# EAGLE design NanoCard (EAGLE 9.5.0)
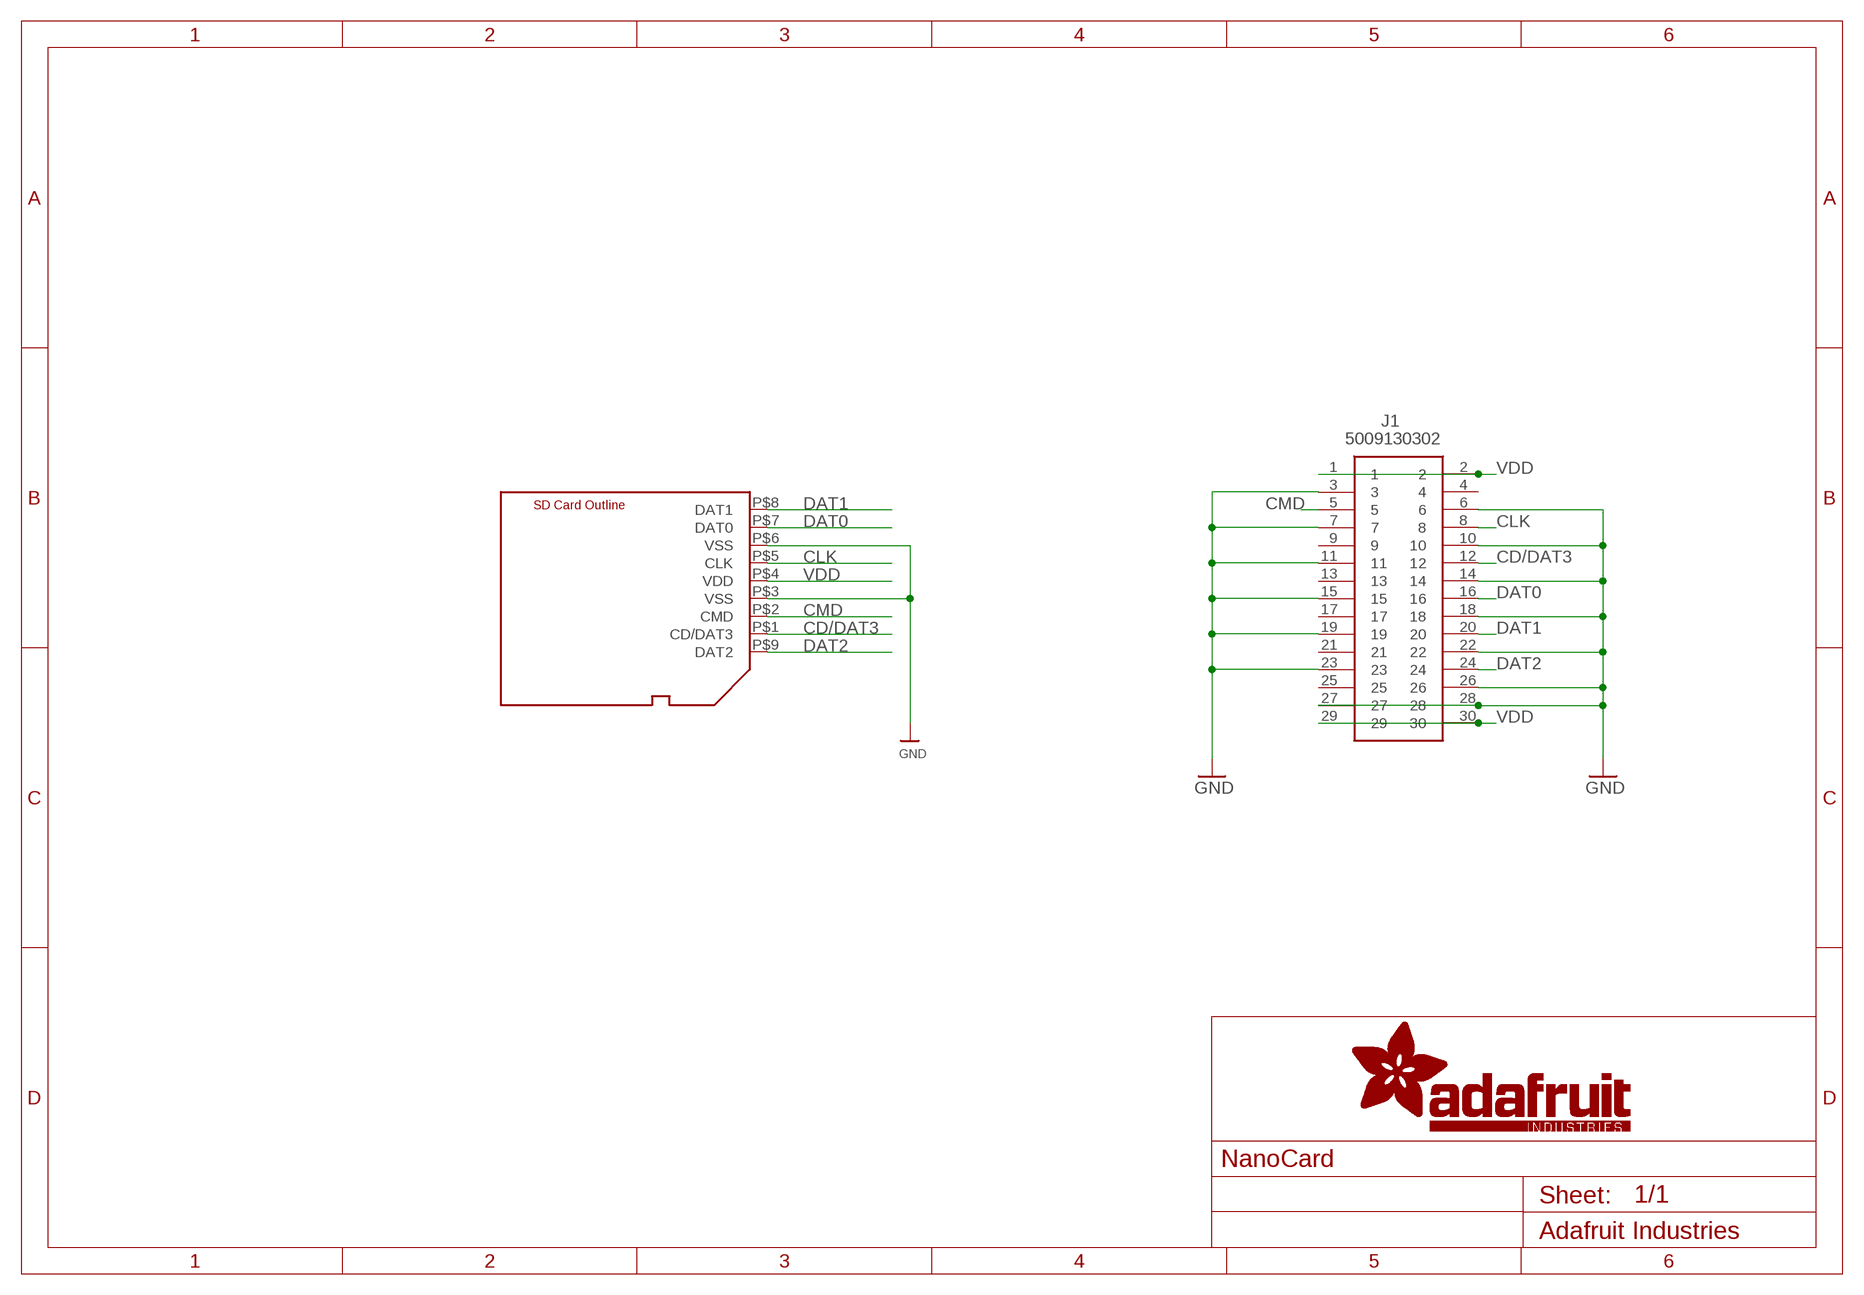
[diagram p0: schematic, sheet 1]

## Parts
J1  5009130302  [500913-0302]
U$2  SDCARD_PCBCARRIERTDOCU  [SDCARD_PCBCARRIER_DOCU]

## Nets
CD/DAT3: J1.12 U$2.P$1(CD/DAT3)
CLK: J1.8 U$2.P$5(CLK)
CMD: J1.5 U$2.P$2(CMD)
DAT0: J1.16 U$2.P$7(DAT0)
DAT1: J1.20 U$2.P$8(DAT1)
DAT2: J1.24 U$2.P$9(DAT2)
GND: J1.3 J1.6 J1.7 J1.10 J1.11 J1.14 J1.15 J1.18 J1.19 J1.22 J1.23 J1.26 J1.27 J1.28 U$2.P$3(VSS) U$2.P$6(VSS)
VDD: J1.1 J1.2 J1.29 J1.30 U$2.P$4(VDD)
Unconnected: J1.4 J1.9 J1.13 J1.17 J1.21 J1.25

## Library data of the parts
J1 = SamacSys_Parts:5009130302: CONN RCPT 30POS 0.4MM SMD GOLD Source: Datasheet <https://www.molex.com/pdm_docs/sd/5009130302_sd.pdf>; DESCRIPTION: CONN RCPT 30POS 0.4MM SMD GOLD; HEIGHT: mm; MANUFACTURER_NAME: Molex; MANUFACTURER_PART_NUMBER: 5009130302
U$2 = microbuilder:SDCARD_PCBCARRIER: Physical PCB representing an SD Card

## Board
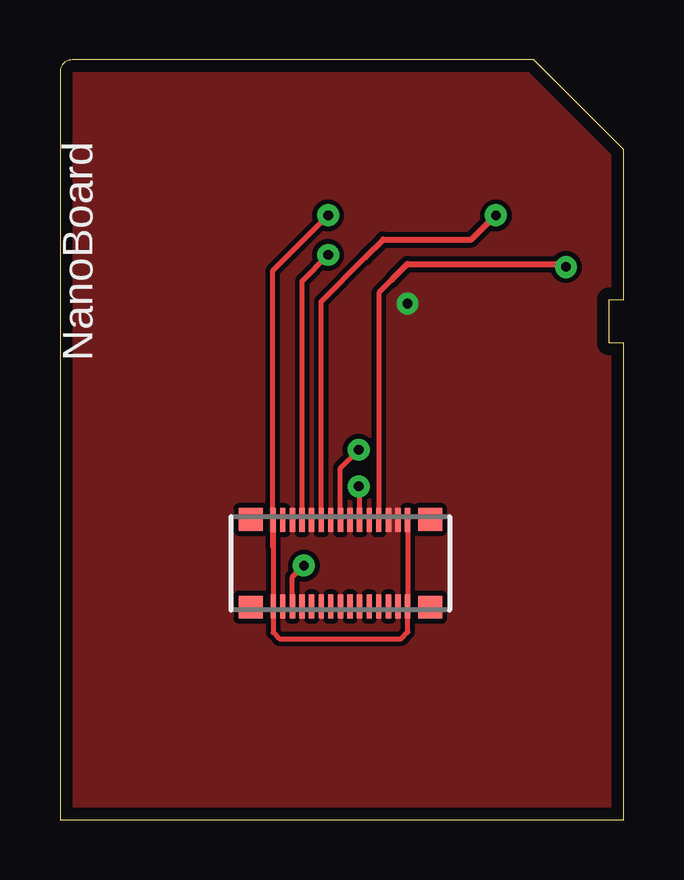
[diagram p1: board, top side]
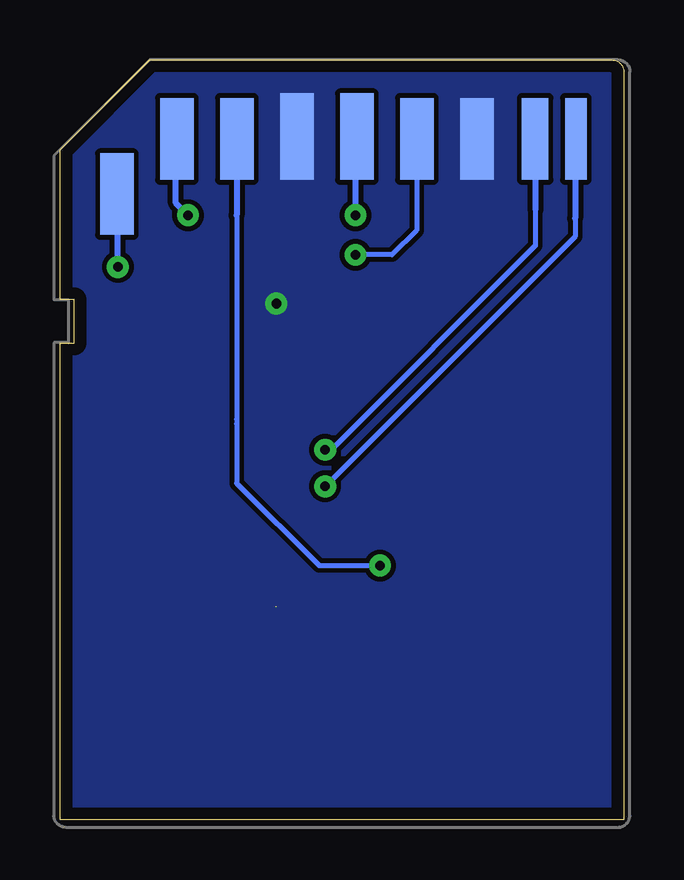
[diagram p2: board, bottom side, seen from below]

Size 23.49 x 31.67 mm. Coordinates in mm from the lower left corner, seen from the top.
Outline: 0,0 23.49,0 23.49,19.87 22.89,19.87 22.89,21.67 23.49,21.67 23.49,27.93 19.75,31.67 0.5,31.67 arc90 0,31.17 0,0
Copper layers (1*16): Top 0.035mm / dielectric 1.5mm / Bottom 0.035mm
Design rules "default *": minimum track width 8mil, minimum drill 0.4mm, track to track 8mil, track to pad 8mil, pad to pad 8mil, via to via 8mil, smd to smd 8mil, copper to edge 20mil, drill to drill 8mil, minimum pad ring 8mil, minimum via ring 10mil, stop-mask expansion 3mil, vias tented up to drill 20mil, thermal gap 0mil

### Footprints (pad centres in the part's own frame; a part is rotated, then mirrored left to right if it is on the bottom)
500913-0302 = smd 0.22 x 1: 1 -2.8,1.85; 2 -2.8,5.45; 3 -2.4,1.85; 4 -2.4,5.45; 5 -2,1.85; 6 -2,5.45; 7 -1.6,1.85; 8 -1.6,5.45; 9 -1.2,1.85; 10 -1.2,5.45; 11 -0.8,1.85; 12 -0.8,5.45; 13 -0.4,1.85; 14 -0.4,5.45; 15 0,1.85; 16 0,5.45; 17 0.4,1.85; 18 0.4,5.45; 19 0.8,1.85; 20 0.8,5.45; 21 1.2,1.85; 22 1.2,5.45; 23 1.6,1.85; 24 1.6,5.45; 25 2,1.85; 26 2,5.45; 27 2.4,1.85; 28 2.4,5.45; 29 2.8,1.85; 30 2.8,5.45 | smd 1 x 0.95: 31 3.738,5.475; 32 3.738,1.825; 33 -3.738,1.825; 34 -3.738,5.475
SDCARD_PCBCARRIER_DOCU = smd 1.4 x 3.4: P$1 -6.875,0; P$2 -4.375,0; P$5 3.125,0; P$6 5.625,0; P$9 -9.375,-2.3 | smd 1.4 x 3.6: P$3 -1.875,0.1; P$4 0.625,0.1 | smd 1.1 x 3.4: P$7 8.05,0 | smd 0.9 x 3.4: P$8 9.75,0

### Placement (x,y rotation side)
J1  11.68,7.04 0 top
U$2  11.75,28.38 0 bottom

### Tracks (layer width: path | path; a pad name or v marks a point on that pad's centre or on a via)
CD/DAT3  (via drill 0.4)
  Top 0.203: 12.73,23.45 10.88,21.61 10.88,13.14 10.88,13.13 J1.12
  Top 0.254: 12.73,23.45 13.46,24.18 17.14,24.18 v18.16,25.2
  Bottom 0.254: v18.16,25.2 18.67,25.71 18.67,28.34 U$2.P$1
CLK  (via drill 0.4)
  Top 0.203: J1.8 10.08,22.46 v11.18,23.55
  Bottom 0.203: 8.64,28.37 8.64,24.57 9.65,23.55 v11.18,23.55
  Bottom 0.254: U$2.P$5 8.64,28.37
CMD  (via drill 0.4)
  Top 0.203: J1.5 9.68,10.12 v10.16,10.6
  Bottom 0.203: 16.13,25.2 16.13,16.69 16.13,16.51 16.13,14.02 12.7,10.6 v10.16,10.6
  Bottom 0.254: 16.13,25.2 16.13,28.38 U$2.P$2
DAT0  (via drill 0.4)
  Top 0.203: v12.45,15.42 11.68,14.66 J1.16
  Bottom 0.203: 3.68,25.45 3.68,23.93 12.19,15.42 v12.45,15.42
  Bottom 0.254: 3.68,25.45 3.68,28.37 U$2.P$7
DAT1  (via drill 0.4)
  Top 0.203: J1.20 12.48,13.86 v12.45,13.9
  Bottom 0.203: 2.03,25.07 2.03,24.31 v12.45,13.9
  Bottom 0.254: 2.03,25.07 2.03,28.35 U$2.P$8
DAT2  (via drill 0.4)
  Top 0.203: 13.83,22.52 13.28,21.97 J1.24
  Top 0.254: 13.83,22.52 14.48,23.17 20.7,23.17 v21.08,23.04
  Bottom 0.254: v21.08,23.04 21.08,26.04 U$2.P$9
GND  (via drill 0.4)
  other vias: 14.48,21.52
  pour Bottom: 0,-0.2 23.49,-0.2 23.49,19.87 22.86,19.87 22.86,21.64 23.49,21.64 23.49,27.74 19.81,31.68 0.51,31.68 arc90 0,31.17
  pour Top: 0,-0.2 23.49,-0.2 23.49,19.87 22.86,19.87 22.86,21.64 23.49,21.64 23.49,27.74 19.81,31.68 0.51,31.68 arc90 0,31.17
VDD  (via drill 0.4)  (1 unrouted)
  Top 0.203: J1.30 J1.29 | J1.2 8.88,11.36 | 8.88,11.36 J1.1 8.88,7.81 9.14,7.55 14.22,7.55 14.5,7.82 14.5,8.89 | 8.88,11.36 8.87,11.37 8.87,22.89 v11.18,25.2
  Bottom 0.254: v11.18,25.2 11.18,28.43 U$2.P$4

### Text on the board
tPlace: NanoBoard